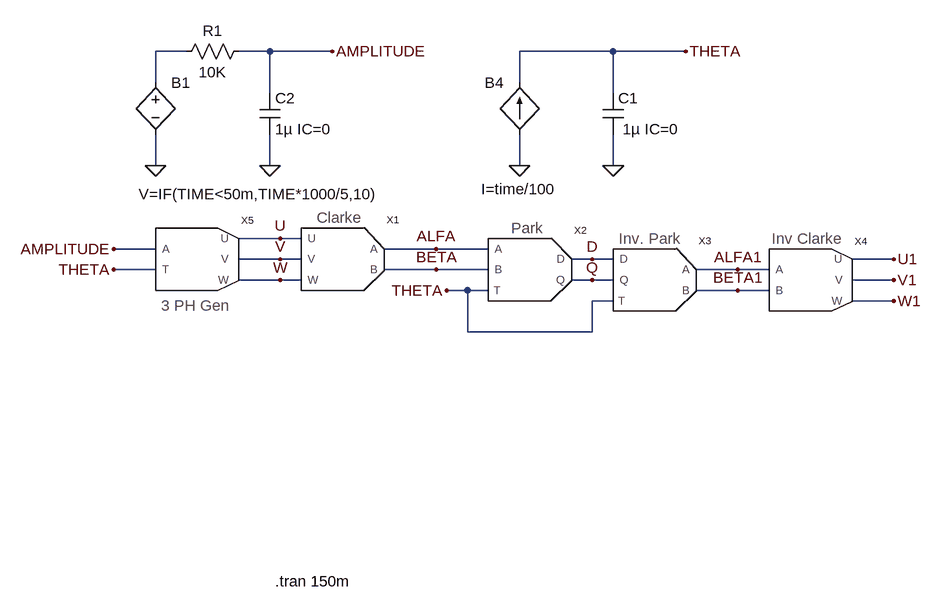
[diagram p0: schematic test_Clarke_Park.asc]
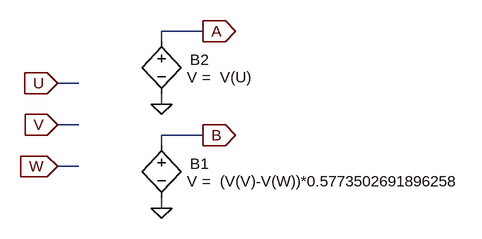
[diagram p1: sub-circuit clarke.asc]
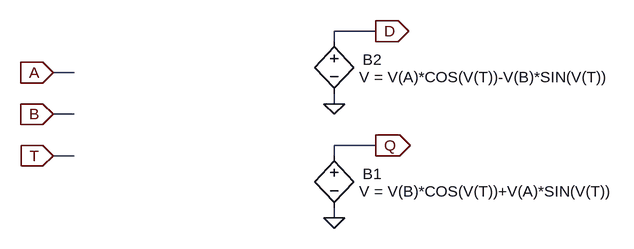
[diagram p2: sub-circuit park.asc]
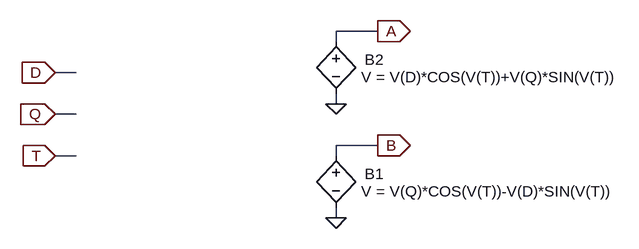
[diagram p3: sub-circuit inv_park.asc]
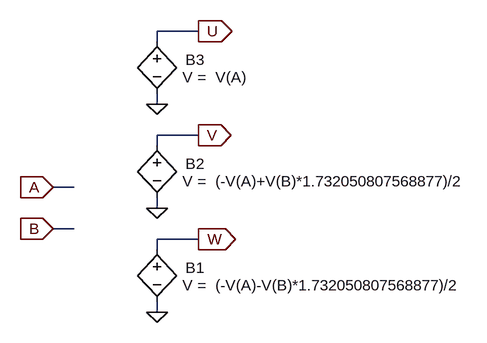
[diagram p4: sub-circuit inv_clarke.asc]
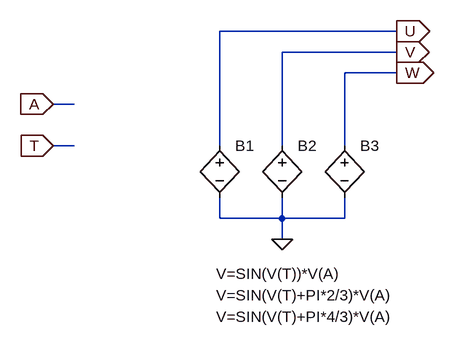
[diagram p5: sub-circuit 3ph_gen.asc]
test_Clarke_Park.asc, the LTspice schematic file:
Version 4
SHEET 1 2208 680
WIRE -16 -336 -64 -336
WIRE 112 -336 64 -336
WIRE 208 -336 112 -336
WIRE 640 -336 496 -336
WIRE 752 -336 640 -336
WIRE -64 -288 -64 -336
WIRE 496 -288 496 -336
WIRE 112 -272 112 -336
WIRE 640 -272 640 -336
WIRE -64 -160 -64 -208
WIRE 112 -160 112 -208
WIRE 496 -160 496 -208
WIRE 640 -160 640 -208
WIRE 128 -48 64 -48
WIRE 160 -48 128 -48
WIRE -64 -32 -128 -32
WIRE 368 -32 288 -32
WIRE 448 -32 368 -32
WIRE 128 -16 64 -16
WIRE 160 -16 128 -16
WIRE 608 -16 576 -16
WIRE 640 -16 608 -16
WIRE 1072 -16 1008 -16
WIRE -64 0 -128 0
WIRE 368 0 288 0
WIRE 448 0 368 0
WIRE 832 0 768 0
WIRE 880 0 832 0
WIRE 128 16 64 16
WIRE 160 16 128 16
WIRE 608 16 576 16
WIRE 640 16 608 16
WIRE 1072 16 1008 16
WIRE 416 32 384 32
WIRE 448 32 416 32
WIRE 832 32 768 32
WIRE 880 32 832 32
WIRE 640 48 608 48
WIRE 1072 48 1008 48
WIRE 416 96 416 32
WIRE 608 96 608 48
WIRE 608 96 416 96
FLAG 640 -160 0
FLAG 128 -48 U
FLAG 128 -16 V
FLAG 128 16 W
FLAG 368 -32 ALFA
FLAG 368 0 BETA
FLAG 608 -16 D
FLAG 608 16 Q
FLAG 752 -336 THETA
FLAG 384 32 THETA
FLAG 832 0 ALFA1
FLAG 832 32 BETA1
FLAG 1072 -16 U1
FLAG 1072 16 V1
FLAG 1072 48 W1
FLAG 112 -160 0
FLAG 208 -336 AMPLITUDE
FLAG -128 -32 AMPLITUDE
FLAG -128 0 THETA
FLAG 496 -160 0
FLAG -64 -160 0
SYMBOL clarke 256 -32 R0
SYMATTR InstName X1
SYMBOL park 544 -16 R0
SYMATTR InstName X2
SYMBOL bi 496 -208 R180
WINDOW 0 24 80 Left 2
WINDOW 3 -55 -84 Left 2
SYMATTR InstName B4
SYMATTR Value I=time/100
SYMBOL cap 624 -272 R0
WINDOW 3 31 56 Left 2
SYMATTR Value 1µ IC=0
SYMATTR InstName C1
SYMBOL inv_park 736 0 R0
SYMATTR InstName X3
SYMBOL inv_clarke 976 0 R0
SYMATTR InstName X4
SYMBOL cap 96 -272 R0
SYMATTR InstName C2
SYMATTR Value 1µ IC=0
SYMBOL res 80 -352 R90
WINDOW 0 0 56 VBottom 2
WINDOW 3 32 56 VTop 2
SYMATTR InstName R1
SYMATTR Value 10K
SYMBOL 3ph_gen 32 -32 R0
SYMATTR InstName X5
SYMBOL bv -64 -304 R0
WINDOW 3 -26 188 Left 2
SYMATTR InstName B1
SYMATTR Value V=IF(TIME<50m,TIME*1000/5,10)
TEXT 120 480 Left 2 !.tran 150m

clarke.asc, the sub-circuit schematic file:
Version 4
SHEET 1 880 680
WIRE 240 0 176 0
WIRE 176 16 176 0
WIRE 48 80 16 80
WIRE 176 112 176 96
WIRE 48 144 16 144
WIRE 240 160 176 160
WIRE 176 176 176 160
WIRE 48 208 16 208
WIRE 176 272 176 256
FLAG 16 80 U
IOPIN 16 80 In
FLAG 16 144 V
IOPIN 16 144 In
FLAG 176 272 0
FLAG 240 160 B
IOPIN 240 160 Out
FLAG 16 208 W
IOPIN 16 208 In
FLAG 176 112 0
FLAG 240 0 A
IOPIN 240 0 Out
SYMBOL bv 176 160 R0
WINDOW 0 44 44 Left 0
WINDOW 3 39 71 Left 0
SYMATTR InstName B1
SYMATTR Value V =  (V(V)-V(W))*0.5773502691896258
SYMBOL bv 176 0 R0
WINDOW 0 44 44 Left 0
WINDOW 3 39 71 Left 0
SYMATTR InstName B2
SYMATTR Value V =  V(U)

park.asc, the sub-circuit schematic file:
Version 4
SHEET 1 892 680
WIRE 272 -16 208 -16
WIRE 208 0 208 -16
WIRE -192 48 -224 48
WIRE 208 96 208 80
WIRE -192 112 -224 112
WIRE 272 160 208 160
WIRE -192 176 -224 176
WIRE 208 176 208 160
WIRE 208 272 208 256
FLAG -224 48 A
IOPIN -224 48 In
FLAG -224 112 B
IOPIN -224 112 In
FLAG 208 272 0
FLAG 272 160 Q
IOPIN 272 160 Out
FLAG 208 96 0
FLAG 272 -16 D
IOPIN 272 -16 Out
FLAG -224 176 T
IOPIN -224 176 In
SYMBOL bv 208 160 R0
WINDOW 0 44 44 Left 2
WINDOW 3 39 71 Left 2
SYMATTR InstName B1
SYMATTR Value V = V(B)*COS(V(T))+V(A)*SIN(V(T))
SYMBOL bv 208 -16 R0
WINDOW 0 44 44 Left 2
WINDOW 3 39 71 Left 2
SYMATTR InstName B2
SYMATTR Value V = V(A)*COS(V(T))-V(B)*SIN(V(T))

inv_park.asc, the sub-circuit schematic file:
Version 4
SHEET 1 892 680
WIRE 272 -16 208 -16
WIRE 208 0 208 -16
WIRE -192 48 -224 48
WIRE 208 96 208 80
WIRE -192 112 -224 112
WIRE 272 160 208 160
WIRE -192 176 -224 176
WIRE 208 176 208 160
WIRE 208 272 208 256
FLAG -224 48 D
IOPIN -224 48 In
FLAG -224 112 Q
IOPIN -224 112 In
FLAG 208 272 0
FLAG 272 160 B
IOPIN 272 160 Out
FLAG 208 96 0
FLAG 272 -16 A
IOPIN 272 -16 Out
FLAG -224 176 T
IOPIN -224 176 In
SYMBOL bv 208 160 R0
WINDOW 0 44 44 Left 2
WINDOW 3 39 71 Left 2
SYMATTR InstName B1
SYMATTR Value V = V(Q)*COS(V(T))-V(D)*SIN(V(T))
SYMBOL bv 208 -16 R0
WINDOW 0 44 44 Left 2
WINDOW 3 39 71 Left 2
SYMATTR InstName B2
SYMATTR Value V = V(D)*COS(V(T))+V(Q)*SIN(V(T))

inv_clarke.asc, the sub-circuit schematic file:
Version 4
SHEET 1 880 680
WIRE 240 -160 176 -160
WIRE 176 -144 176 -160
WIRE 176 -48 176 -64
WIRE 240 0 176 0
WIRE 176 16 176 0
WIRE 48 80 16 80
WIRE 176 112 176 96
WIRE 48 144 16 144
WIRE 240 160 176 160
WIRE 176 176 176 160
WIRE 176 272 176 256
FLAG 16 80 A
IOPIN 16 80 In
FLAG 16 144 B
IOPIN 16 144 In
FLAG 176 272 0
FLAG 240 160 W
IOPIN 240 160 Out
FLAG 176 112 0
FLAG 240 0 V
IOPIN 240 0 Out
FLAG 176 -48 0
FLAG 240 -160 U
IOPIN 240 -160 Out
SYMBOL bv 176 160 R0
WINDOW 0 44 44 Left 0
WINDOW 3 39 71 Left 0
SYMATTR InstName B1
SYMATTR Value V =  (-V(A)-V(B)*1.732050807568877)/2
SYMBOL bv 176 0 R0
WINDOW 0 44 44 Left 0
WINDOW 3 39 71 Left 0
SYMATTR InstName B2
SYMATTR Value V =  (-V(A)+V(B)*1.732050807568877)/2
SYMBOL bv 176 -160 R0
WINDOW 0 44 44 Left 0
WINDOW 3 39 71 Left 0
SYMATTR InstName B3
SYMATTR Value V =  V(A)

3ph_gen.asc, the sub-circuit schematic file:
Version 4
SHEET 1 880 680
WIRE 512 32 240 32
WIRE 512 64 336 64
WIRE 512 96 432 96
WIRE 16 144 -16 144
WIRE 16 208 -16 208
WIRE 240 208 240 32
WIRE 336 208 336 64
WIRE 432 208 432 96
WIRE 240 320 240 288
WIRE 336 320 336 288
WIRE 336 320 240 320
WIRE 432 320 432 288
WIRE 432 320 336 320
WIRE 336 352 336 320
FLAG 336 352 0
FLAG 512 32 U
IOPIN 512 32 Out
FLAG 512 64 V
IOPIN 512 64 Out
FLAG 512 96 W
IOPIN 512 96 Out
FLAG -16 144 A
IOPIN -16 144 In
FLAG -16 208 T
IOPIN -16 208 In
SYMBOL bv 240 192 R0
WINDOW 3 -5 213 Left 2
SYMATTR InstName B1
SYMATTR Value V=SIN(V(T))*V(A)
SYMBOL bv 336 192 R0
WINDOW 3 -101 246 Left 2
SYMATTR InstName B2
SYMATTR Value V=SIN(V(T)+PI*2/3)*V(A)
SYMBOL bv 432 192 R0
WINDOW 3 -197 279 Left 2
SYMATTR InstName B3
SYMATTR Value V=SIN(V(T)+PI*4/3)*V(A)

The netlist it stands for:
* test_Clarke_Park.asc
XX1 BETA U W V ALFA clarke
XX2 D Q ALFA BETA THETA park
B4 0 THETA I=time/100
C1 THETA 0 1µ IC=0
XX3 ALFA1 BETA1 D Q THETA inv_park
XX4 BETA1 U1 W1 V1 ALFA1 inv_clarke
C2 AMPLITUDE 0 1µ IC=0
R1 AMPLITUDE N001 10K
XX5 THETA U W V AMPLITUDE 3ph_gen
B1 N001 0 V=IF(TIME<50m,TIME*1000/5,10)

* block symbol definitions
.subckt clarke B U W V A
B1 B 0 V =  (V(V)-V(W))*0.5773502691896258
B2 A 0 V =  V(U)
.ends clarke

.subckt park D Q A B T
B1 Q 0 V = V(B)*COS(V(T))+V(A)*SIN(V(T))
B2 D 0 V = V(A)*COS(V(T))-V(B)*SIN(V(T))
.ends park

.subckt inv_park A B D Q T
B1 B 0 V = V(Q)*COS(V(T))-V(D)*SIN(V(T))
B2 A 0 V = V(D)*COS(V(T))+V(Q)*SIN(V(T))
.ends inv_park

.subckt inv_clarke B U W V A
B1 W 0 V =  (-V(A)-V(B)*1.732050807568877)/2
B2 V 0 V =  (-V(A)+V(B)*1.732050807568877)/2
B3 U 0 V =  V(A)
.ends inv_clarke

.subckt 3ph_gen T U W V A
B1 U 0 V=SIN(V(T))*V(A)
B2 V 0 V=SIN(V(T)+PI*2/3)*V(A)
B3 W 0 V=SIN(V(T)+PI*4/3)*V(A)
.ends 3ph_gen

.tran 150m
.backanno
.end